# EasyEDA Pro project 外接板20260106.eprj

# Schematic Schematic1
Board Name: Board1; Create Date: 2025-08-14; Page Name: P1; Project Name: 外接板20250814 - 副本; Schematic Name: Schematic1; Update Date: 2025-11-26; Company: 嘉立创EDA; Page Size: A4; Version: V1.0
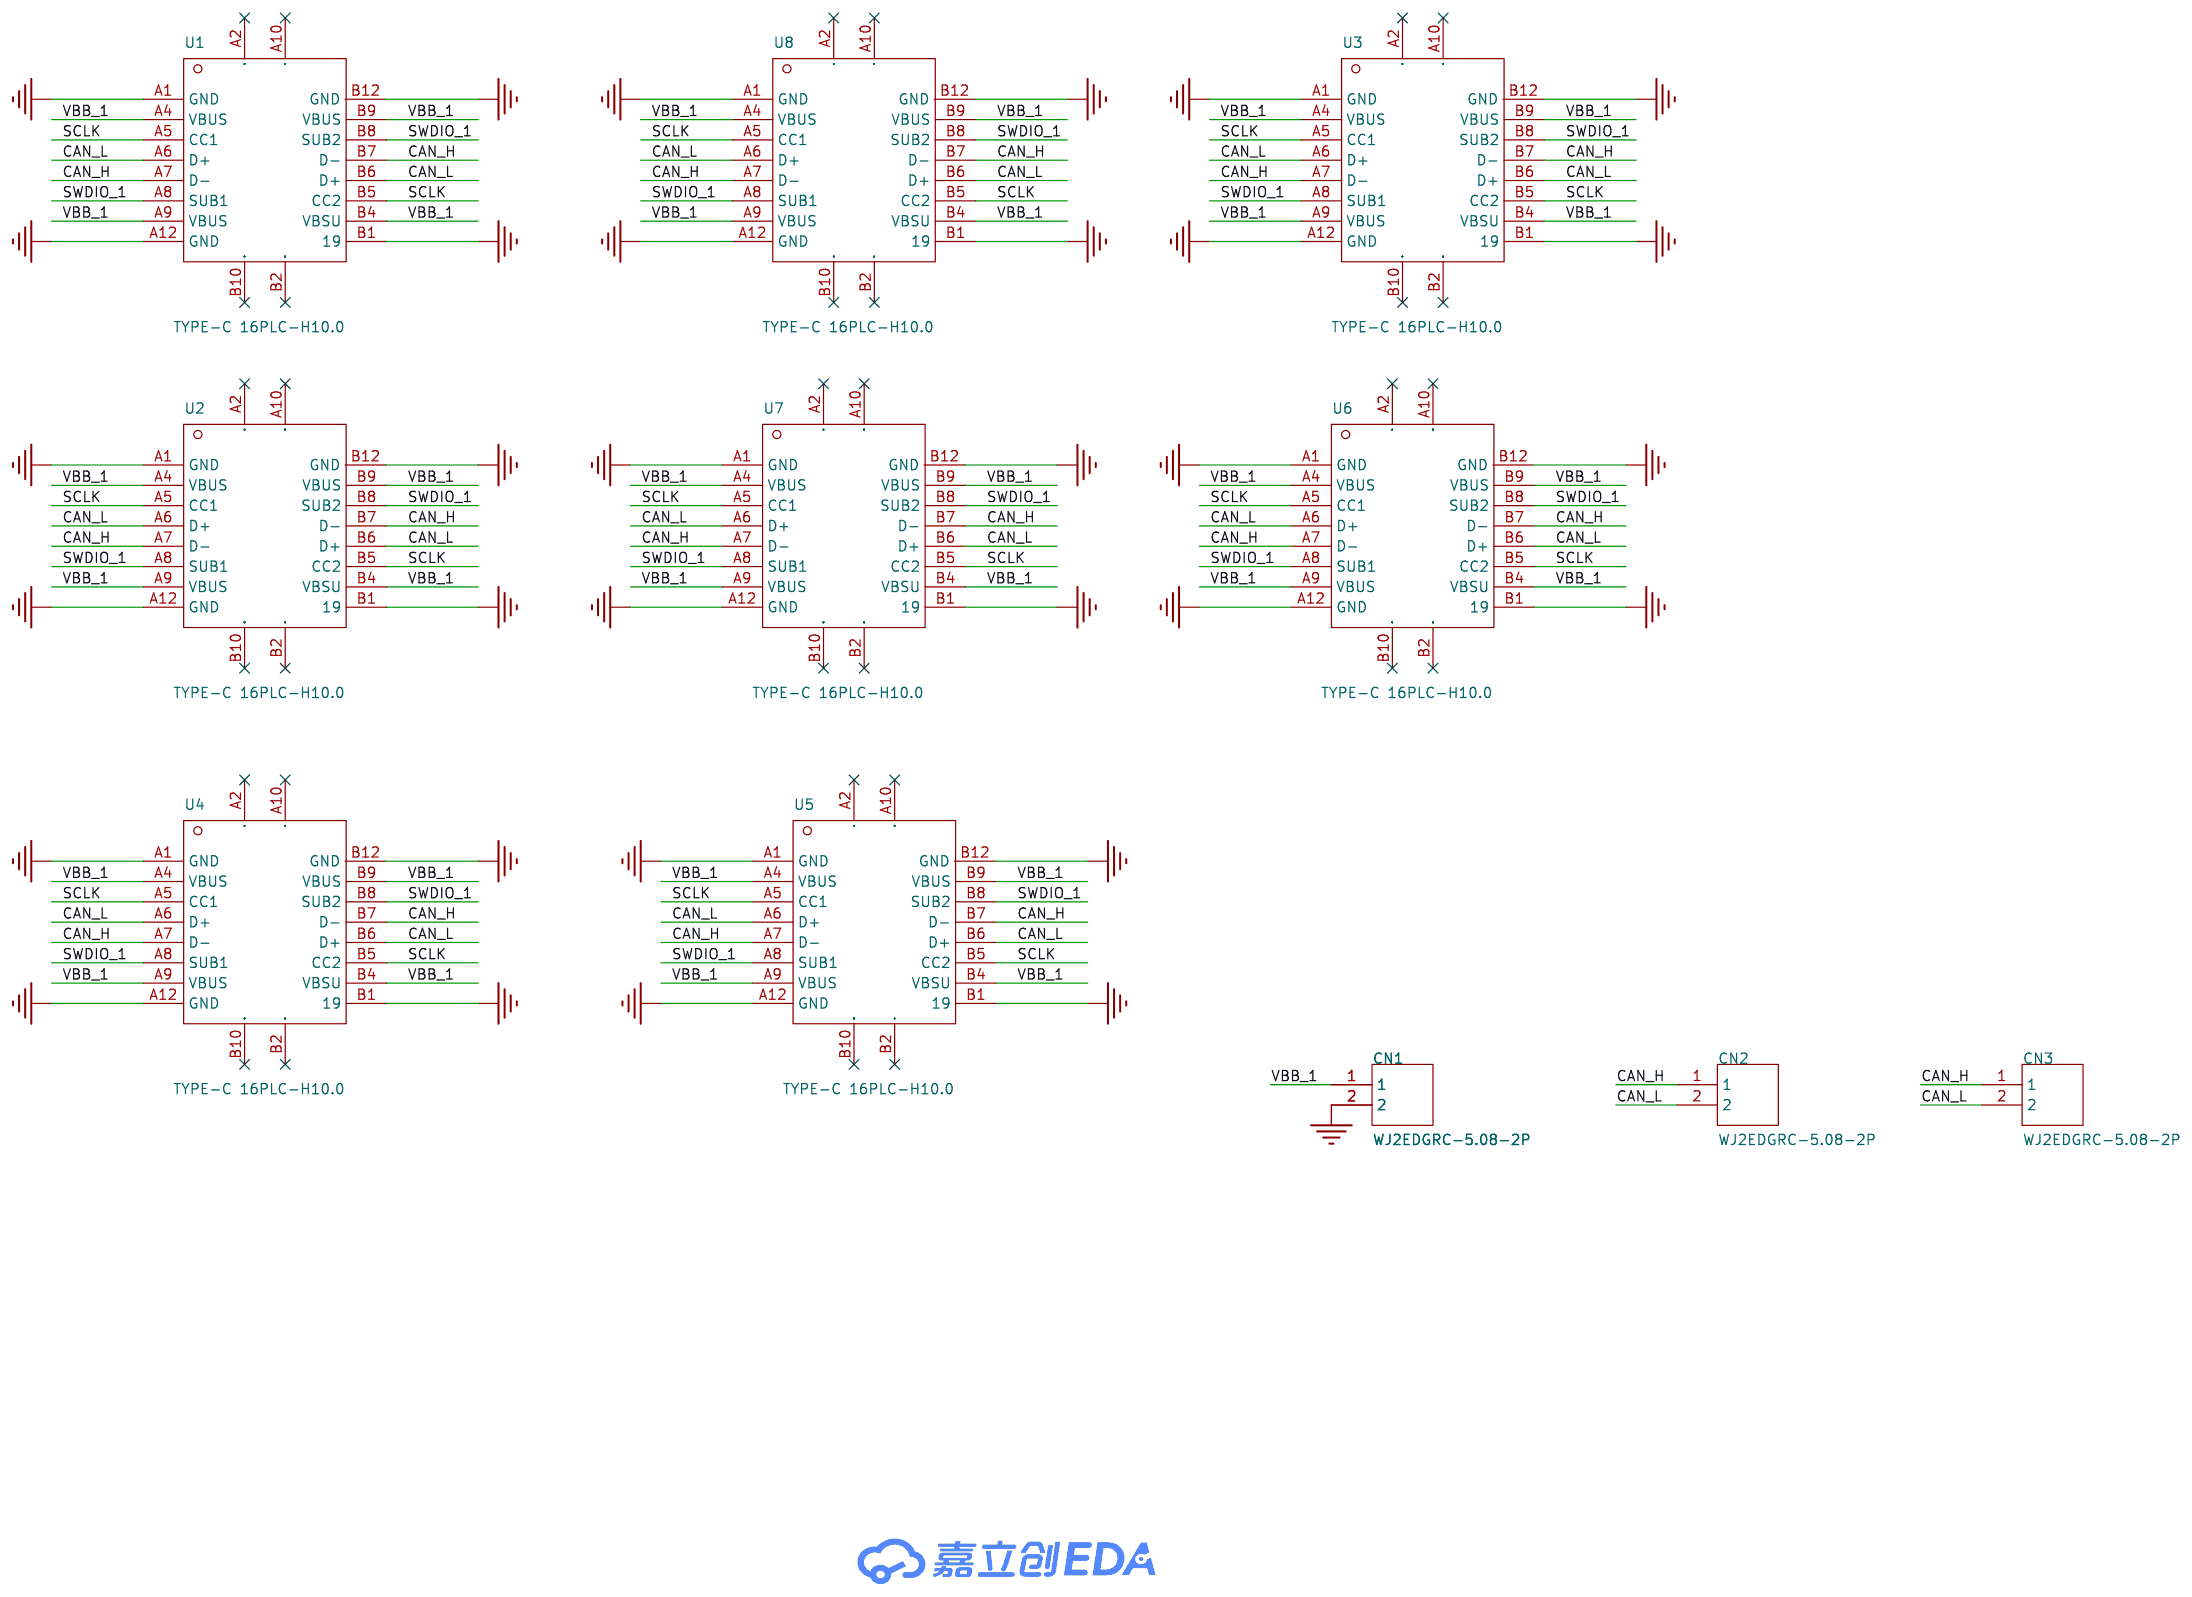
[diagram p0: schematic sheet]

## Parts
CN1  WJ2EDGRC-5.08-2P  [CONN-TH_2P-P5.08_WJ2EDGRC-5.08-2P]
CN2  WJ2EDGRC-5.08-2P  [CONN-TH_2P-P5.08_WJ2EDGRC-5.08-2P]
CN3  WJ2EDGRC-5.08-2P  [CONN-TH_2P-P5.08_WJ2EDGRC-5.08-2P]
U1  TYPE-C 16PLC-H10.0  [TYPE-C-TH_16PLC-H10.0]
U2  TYPE-C 16PLC-H10.0  [TYPE-C-TH_16PLC-H10.0]
U3  TYPE-C 16PLC-H10.0  [TYPE-C-TH_16PLC-H10.0]
U4  TYPE-C 16PLC-H10.0  [TYPE-C-TH_16PLC-H10.0]
U5  TYPE-C 16PLC-H10.0  [TYPE-C-TH_16PLC-H10.0]
U6  TYPE-C 16PLC-H10.0  [TYPE-C-TH_16PLC-H10.0]
U7  TYPE-C 16PLC-H10.0  [TYPE-C-TH_16PLC-H10.0]
U8  TYPE-C 16PLC-H10.0  [TYPE-C-TH_16PLC-H10.0]

## Library data of the parts
CN1-CN3 = WJ2EDGRC-5.08-2P: 连接器类型:板端/插座-闭口;固定方式:-;结构:1x2P;间距:5.08mm;颜色:绿色;安装方式:弯针;排数:1;每排PIN数:2;额定电流:20A;额定电压:450V;线规 - AWG:-;线规 - 平方毫米:-;触头材质:黄铜;触头镀层:锡;工作温度范围:-40℃~+105℃;焊接温度(最大值):-;; LCSC Part Name: 1x2P 5.08mm 排数:1 每排P数:2; Supplier Part: C3697; Manufacturer: KANGNEX(康奈克斯电气); Supplier Footprint: 弯插,P=5.08mm; JLCPCB Part Class: 扩展库; Datasheet: https://atta.szlcsc.com/upload/public/pdf/source/20240813/4D8AF133EBD88DD18E5AA0CE5EC77AA3.pdf; Supplier: LCSC; Connector Type: 板端/插座-闭口; Structure: 1x2P; Pitch: 5.08mm; Color: 绿色; Mounting Style: 弯针; Number of Pins: 2P; Number of Rows: 1; Number of PINs Per Row: 2; Current Rating (Max): 20A; Voltage Rating (Max): 450V; Contact Material: 黄铜; Contact Plating: 锡; Operating Temperature Range: -40℃~+105℃
U1-U8 = TYPE-C 16PLC-H10.0: 连接器类型:Type-C;标准:USB 3.1;公母:母;安装方式:直插;触点数量:16P;端口数量:1;额定电流 - 电源:5A;触头材质:-;触头镀层:-;工作温度范围:-40℃~+85℃;; LCSC Part Name: Type-C 母 直插; Supplier Part: C3151747; Manufacturer: SHOU HAN(首韩); Supplier Footprint: 插件; JLCPCB Part Class: 扩展库; Datasheet: https://atta.szlcsc.com/upload/public/pdf/source/20240529/CC9428849977884A813B584EA396EFE9.pdf; Supplier: LCSC; Connector Type: Type-C; Standard: USB 3.1; Gender: 母; Mounting Style: 直插; Number of Contacts: 16P; Number of Ports: 1; Current Rating - Power (Max): 5A; Operating Temperature Range: -40℃~+85℃; Rated Voltage (Max): 20V; Connect-Disconnect Life: 1万次; Core Colour: 黑色

## Nets
GND: CN1.2 U1.A1(GND) U1.A12(GND) U1.B1(19) U1.B12(GND) U2.A1(GND) U2.A12(GND) U2.B1(19) U2.B12(GND) U3.A1(GND) U3.A12(GND) U3.B1(19) U3.B12(GND) U4.A1(GND) U4.A12(GND) U4.B1(19) U4.B12(GND) U5.A1(GND) U5.A12(GND) U5.B1(19) U5.B12(GND) U6.A1(GND) U6.A12(GND) U6.B1(19) U6.B12(GND) U7.A1(GND) U7.A12(GND) U7.B1(19) U7.B12(GND) U8.A1(GND) U8.A12(GND) U8.B1(19) U8.B12(GND)
CAN_H: CN2.1 CN3.1 U1.A7(D-) U1.B7(D-) U2.A7(D-) U2.B7(D-) U3.A7(D-) U3.B7(D-) U4.A7(D-) U4.B7(D-) U5.A7(D-) U5.B7(D-) U6.A7(D-) U6.B7(D-) U7.A7(D-) U7.B7(D-) U8.A7(D-) U8.B7(D-)
CAN_L: CN2.2 CN3.2 U1.A6(D+) U1.B6(D+) U2.A6(D+) U2.B6(D+) U3.A6(D+) U3.B6(D+) U4.A6(D+) U4.B6(D+) U5.A6(D+) U5.B6(D+) U6.A6(D+) U6.B6(D+) U7.A6(D+) U7.B6(D+) U8.A6(D+) U8.B6(D+)
SCLK: U1.A5(CC1) U1.B5(CC2) U2.A5(CC1) U2.B5(CC2) U3.A5(CC1) U3.B5(CC2) U4.A5(CC1) U4.B5(CC2) U5.A5(CC1) U5.B5(CC2) U6.A5(CC1) U6.B5(CC2) U7.A5(CC1) U7.B5(CC2) U8.A5(CC1) U8.B5(CC2)
SWDIO_1: U1.A8(SUB1) U1.B8(SUB2) U2.A8(SUB1) U2.B8(SUB2) U3.A8(SUB1) U3.B8(SUB2) U4.A8(SUB1) U4.B8(SUB2) U5.A8(SUB1) U5.B8(SUB2) U6.A8(SUB1) U6.B8(SUB2) U7.A8(SUB1) U7.B8(SUB2) U8.A8(SUB1) U8.B8(SUB2)
VBB_1: CN1.1 U1.A4(VBUS) U1.A9(VBUS) U1.B4(VBSU) U1.B9(VBUS) U2.A4(VBUS) U2.A9(VBUS) U2.B4(VBSU) U2.B9(VBUS) U3.A4(VBUS) U3.A9(VBUS) U3.B4(VBSU) U3.B9(VBUS) U4.A4(VBUS) U4.A9(VBUS) U4.B4(VBSU) U4.B9(VBUS) U5.A4(VBUS) U5.A9(VBUS) U5.B4(VBSU) U5.B9(VBUS) U6.A4(VBUS) U6.A9(VBUS) U6.B4(VBSU) U6.B9(VBUS) U7.A4(VBUS) U7.A9(VBUS) U7.B4(VBSU) U7.B9(VBUS) U8.A4(VBUS) U8.A9(VBUS) U8.B4(VBSU) U8.B9(VBUS)

Not connected (* = marked no-connect by the designer): U1 A2(GND1)* A10(GND2)* B2(GND4)* B10(GND3)*; U2 A2(GND1)* A10(GND2)* B2(GND4)* B10(GND3)*; U3 A2(GND1)* A10(GND2)* B2(GND4)* B10(GND3)*; U4 A2(GND1)* A10(GND2)* B2(GND4)* B10(GND3)*; U5 A2(GND1)* A10(GND2)* B2(GND4)* B10(GND3)*; U6 A2(GND1)* A10(GND2)* B2(GND4)* B10(GND3)*; U7 A2(GND1)* A10(GND2)* B2(GND4)* B10(GND3)*; U8 A2(GND1)* A10(GND2)* B2(GND4)* B10(GND3)*

# Board PCB5
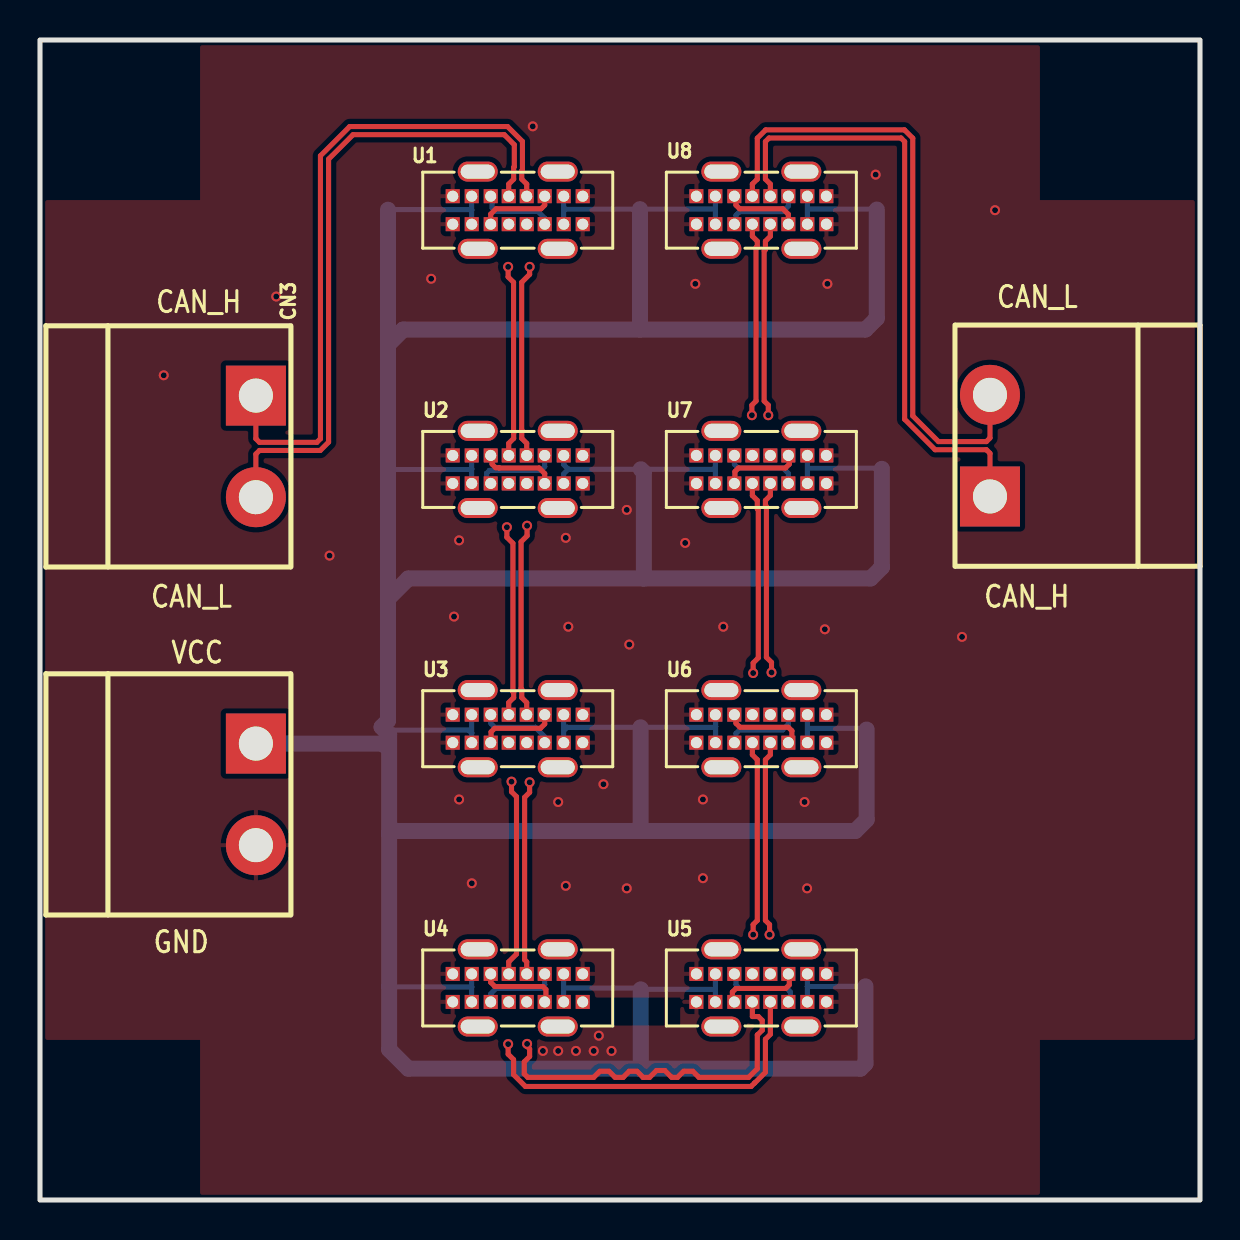
[diagram p1: board, top side]
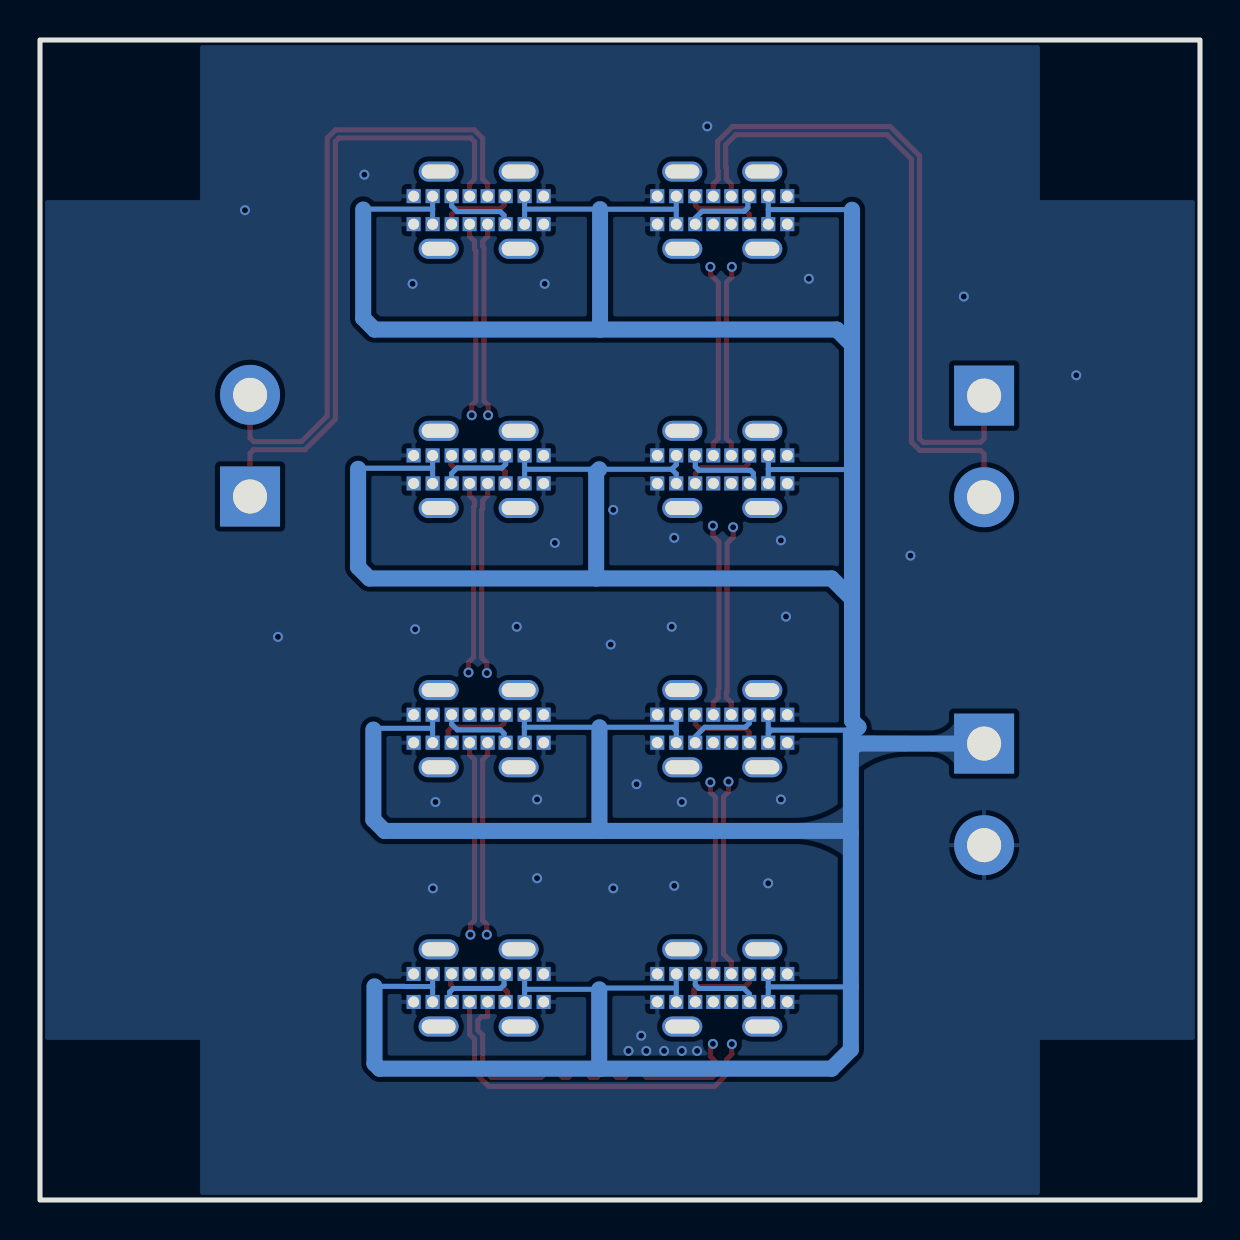
[diagram p2: board, bottom side, seen from below]

Outline 58 x 58 mm; copper layers: Top Layer, 内层1, 内层2, Bottom Layer. Coordinates in mm from the lower left corner of the outline.
Outline path: rectangle 0,58 58,0
Stack: Top Layer 0.035mm 外层铜厚1oz / Dielectric1 0.2104mm 7628 RC49% 8.6mil / 内层1 0.0152mm 内层铜厚 / Dielectric2 1.065mm 1.1mm H/HOZ Copper / 内层2 0.0152mm 内层铜厚 / Dielectric3 0.2104mm 7628 RC49% 8.6mil / Bottom Layer 0.035mm 外层铜厚1oz

## Design rules (mm)
net CAN_L: DP1
net CAN_H: DP1
template: JLCPCB Capability(Two Layers Board)
spacing copperThickness1oz (default): track to track 0.102, other pairs 0.152 to 0.3
spacing copperThickness2oz: track to track 0.203, other pairs 0.152 to 0.3
track width copperThickness1oz (default): min 0.127, default 0.254, max 2.54
track width copperThickness2oz: min 0.203, default 0.254, max 2.54
differential pair differentialPair (default): width min 0.127, default 0.254, max 2.54; gap min 0.152, default 0.152
via viaSize (default): diameter min 0.5, default 0.61, max 10; hole min 0.3, default 0.305, max 6.3

## Placement (name value [footprint] x y rotation side)
CN1  WJ2EDGRC-5.08-2P  [CONN-TH_2P-P5.08_WJ2EDGRC-5.08-2P]  10.79 20.28 270 top
CN2  WJ2EDGRC-5.08-2P  [CONN-TH_2P-P5.08_WJ2EDGRC-5.08-2P]  47.5 37.72 90 top
CN3  WJ2EDGRC-5.08-2P  [CONN-TH_2P-P5.08_WJ2EDGRC-5.08-2P]  10.79 37.68 270 top
U1  TYPE-C 16PLC-H10.0  [TYPE-C-TH_16PLC-H10.0]  23.89 49.49 0 top
U2  TYPE-C 16PLC-H10.0  [TYPE-C-TH_16PLC-H10.0]  23.89 36.53 0 top
U3  TYPE-C 16PLC-H10.0  [TYPE-C-TH_16PLC-H10.0]  23.89 23.57 0 top
U4  TYPE-C 16PLC-H10.0  [TYPE-C-TH_16PLC-H10.0]  23.89 10.6 0 top
U5  TYPE-C 16PLC-H10.0  [TYPE-C-TH_16PLC-H10.0]  36.07 10.6 0 top
U6  TYPE-C 16PLC-H10.0  [TYPE-C-TH_16PLC-H10.0]  36.07 23.57 0 top
U7  TYPE-C 16PLC-H10.0  [TYPE-C-TH_16PLC-H10.0]  36.07 36.53 0 top
U8  TYPE-C 16PLC-H10.0  [TYPE-C-TH_16PLC-H10.0]  36.07 49.49 0 top

## Footprints (pads in the part's own frame, mm; a bottom-side part is the same pattern mirrored in y, then rotated)
CONN-TH_2P-P5.08_WJ2EDGRC-5.08-2P
  rect 3x3 hole 1.7: 1(-2.54,0)
  round 3 hole 1.7: 2(2.54,0)
TYPE-C-TH_16PLC-H10.0
  rect 0.7x0.7 hole 0.55: A1(-3.25,0.7) A4(-2.3,0.7) A5(-1.351,0.7) A6(-0.45,0.7) A7(0.45,0.7) A8(1.35,0.7) A9(2.3,0.7) A12(3.25,0.7) B1(3.25,-0.7) B4(2.3,-0.7) B5(1.35,-0.7) B6(0.45,-0.7) B7(-0.45,-0.7) B8(-1.351,-0.7) B9(-2.3,-0.7) B12(-3.25,-0.7)
  oval 2x1 hole 1.7x0.7: A2(-2,1.93) A10(2,1.93) B2(2,-1.93) B10(-2,-1.93)

## Nets
As in the schematic.

Pads without a net: U1 A2 A10 B2 B10; U2 A2 A10 B2 B10; U3 A2 A10 B2 B10; U4 A2 A10 B2 B10; U5 A2 A10 B2 B10; U6 A2 A10 B2 B10; U7 A2 A10 B2 B10; U8 A2 A10 B2 B10

## Via types
v1: diameter 0.5, hole 0.3, Top Layer to Bottom Layer, 49 vias

## Routing (per net, layer and track width the routed paths; a pad name or vN(x,y) marks a point on that pad's centre or on a via; arc(x,y) is an arc through that point)
GND:
  vias: v1(6.19,41.24) v1(11.81,45.17) v1(14.48,32.22) v1(19.56,46.06) v1(20.7,29.17) v1(20.96,32.98) v1(20.96,20.03) v1(21.59,15.84) v1(24.64,53.68) v1(25.15,7.45) v1(25.91,19.9) v1(25.91,7.45) v1(26.29,33.11) v1(26.29,15.71) v1(26.42,28.66) v1(26.8,7.45) v1(27.69,7.45) v1(27.94,8.22) v1(28.17,20.79) v1(28.57,7.45) v1(29.34,34.5) v1(29.34,15.58) v1(29.46,27.77) v1(32.26,32.85) v1(32.77,45.81) v1(33.15,20.03) v1(33.15,16.09) v1(34.16,28.66) v1(38.23,19.9) v1(38.35,15.58) v1(39.24,28.54) v1(39.37,45.81) v1(41.78,51.27) v1(46.1,28.16) v1(47.75,49.49)
CAN_H: length 175.1
  Top Layer w0.254: U7.B7 35.62,35.22 35.87,34.98 35.87,34.56 35.91,34.51 35.91,27.11 35.66,26.85 v1(35.66,26.35) ; v1(24.48,46.66) 24.48,46.28 24.08,45.88 24.08,38.51 24.09,38.5 24.09,38.08 24.34,37.83 U2.A7 ; U6.B7 35.62,22.26 35.87,22.01 35.87,13.98 35.66,13.77 v1(35.66,13.27) ; U3.A7 24.34,24.87 24.09,25.12 24.09,25.54 24.05,25.58 24.05,32.91 24.35,33.21 v1(24.35,33.71) ; U8.B7 35.62,48.19 35.87,47.94 35.87,47.69 35.8,47.62 35.8,39.95 35.59,39.74 v1(35.59,39.24) ; U8.A7 36.52,50.8 36.27,51.04 36.27,52.92 36.45,53.1 43.05,53.1 43.23,52.92 43.23,39.04 44.75,37.51 47.32,37.51 47.5,37.33 CN2.1 ; v1(24.35,7.81) 24.35,7.68 24.48,7.55 24.48,7.17 24.21,6.9 24.21,6.31 24.39,6.13 27.69,6.13 27.99,6.44 28.45,6.44 28.75,6.13 29.16,6.13 29.46,6.44 29.84,6.44 30.15,6.13 30.48,6.13 30.82,6.47 31.24,6.47 31.59,6.13 31.88,6.13 32.18,6.44 32.64,6.44 32.95,6.13 35.43,6.13 35.87,6.56 35.87,8.26 35.88,8.26 36.11,8.49 36.11,8.98 35.92,9.17 35.62,9.17 U5.B7 ; U1.A7 24.34,50.8 24.09,51.04 24.09,51.46 24.12,51.5 24.12,52.93 23.38,53.67 15.49,53.67 14.02,52.21 14.02,38.06 13.84,37.88 10.97,37.88 10.79,38.06 CN3.1 ; v1(24.48,20.89) 24.48,20.38 24.23,20.13 24.23,12.01 24.34,11.91 U4.A7
  内层1 w0.254: U8.B7 35.62,49.26 35.81,49.46 36.36,49.46 36.52,49.62 U8.A7 ; U1.A7 24.34,49.7 24.13,49.49 23.62,49.49 23.44,49.31 U1.B7 23.5,48.73 23.5,47.78 24.42,46.86 24.42,46.72 v1(24.48,46.66) ; U4.A7 24.34,10.83 24.11,10.61 23.59,10.61 23.44,10.45 U4.B7 23.44,8.72 v1(24.35,7.81) ; v1(35.66,13.27) 36.52,12.41 U5.A7 36.52,10.76 36.34,10.58 36.3,10.61 35.81,10.61 35.62,10.42 U5.B7 ; v1(35.59,39.24) 36.52,38.31 U7.A7 36.52,36.66 36.36,36.5 35.78,36.5 35.62,36.34 U7.B7 ; v1(24.35,33.71) 23.44,34.63 U2.B7 23.44,36.3 23.62,36.48 24.13,36.48 24.34,36.69 U2.A7 ; v1(24.48,20.89) 23.56,21.81 23.56,22.74 U3.B7 23.44,23.38 23.62,23.57 24.12,23.57 24.34,23.79 U3.A7 ; v1(35.66,26.35) 36.52,25.49 U6.A7 36.52,23.84 36.26,23.58 35.81,23.58 35.62,23.39 U6.B7
CAN_L: length 175.2
  Top Layer w0.254: U6.B6 36.52,22.26 36.27,22.01 36.27,13.98 36.48,13.77 v1(36.48,13.27) ; U3.A6 23.44,24.87 23.68,25.12 23.68,25.37 23.65,25.41 23.65,32.83 23.34,33.14 v1(23.34,33.64) ; v1(23.41,7.8) 23.41,7.29 23.68,7.02 23.68,6.27 24.27,5.68 35.55,5.68 35.73,5.85 35.74,5.85 36.27,6.39 36.27,8.04 36.52,8.28 U5.B6 ; U2.A6 23.44,37.83 23.68,38.08 23.68,38.33 23.68,38.34 23.68,45.88 23.41,46.15 v1(23.41,46.66) ; v1(36.41,39.24) 36.41,39.74 36.21,39.95 36.21,47.45 36.27,47.52 36.27,47.94 36.52,48.19 U8.B6 ; v1(36.58,26.38) 36.58,26.88 36.32,27.14 36.32,34.67 36.27,34.72 36.27,34.98 36.52,35.22 U7.B6 ; U1.A6 23.44,50.8 23.68,51.04 23.68,51.63 23.72,51.67 23.72,52.76 23.21,53.27 15.65,53.27 14.43,52.04 14.43,37.89 14.01,37.48 10.97,37.48 10.79,37.3 CN3.2 ; U8.A6 35.62,50.8 35.87,51.04 35.87,53.09 36.28,53.51 43.22,53.51 43.64,53.09 43.64,39.2 44.92,37.92 47.32,37.92 47.5,38.1 CN2.2 ; U4.A6 23.44,11.91 23.82,12.3 23.82,20.16 23.58,20.41 v1(23.58,20.92)
  内层2 w0.254: U2.A6 23.44,36.72 23.62,36.54 24.13,36.54 24.34,36.33 U2.B6 24.34,34.63 v1(23.34,33.64) ; U3.A6 23.44,23.77 23.62,23.58 24.13,23.58 24.34,23.38 U3.B6 24.34,21.55 23.7,20.92 v1(23.58,20.92) ; U8.B6 36.52,49.3 36.32,49.49 35.81,49.49 35.62,49.69 U8.A6 ; U5.B6 36.52,10.4 36.32,10.59 35.78,10.59 35.62,10.76 U5.A6 35.62,12.41 v1(36.48,13.27) ; v1(36.41,39.24) 35.62,38.44 U7.A6 35.62,36.66 35.78,36.5 36.32,36.5 36.52,36.31 U7.B6 ; v1(36.58,26.38) 35.62,25.42 U6.A6 35.62,23.65 35.78,23.49 36.08,23.49 36.09,23.49 36.32,23.49 36.52,23.29 U6.B6 ; v1(23.41,46.66) 23.53,46.66 24.46,47.59 24.46,48.66 U1.B6 24.34,49.23 24.07,49.49 23.62,49.49 23.44,49.68 U1.A6 ; v1(23.41,7.8) 24.34,8.72 U4.B6 24.34,10.42 24.13,10.63 23.62,10.63 23.44,10.81 U4.A6
SCLK: length 112.1
  Top Layer w0.254: U8.A5 34.8,50.11 34.8,49.75 34.98,49.56 37.14,49.56 37.42,49.28 U8.B5 ; U6.A5 34.8,24.19 34.8,23.84 35,23.64 37.42,23.64 37.59,23.46 37.59,22.93 37.53,22.87 U6.B5 ; U2.B5 25.24,36.32 24.96,36.6 22.97,36.6 22.96,36.61 22.79,36.61 22.61,36.79 22.61,37.16 U2.A5 ; U4.A5 22.54,10.88 22.75,10.67 25.15,10.67 25.3,10.52 25.3,9.96 U4.B5
  内层2 w0.254: 28.63,10.55 25.45,10.55 25.27,10.38 25.27,9.94 U4.B5 ; 28.63,10.55 28.7,10.63 28.7,23.46 ; 28.63,10.55 34.42,10.55 34.72,10.86 U5.A5 ; 28.7,36.59 28.7,23.46 ; 28.7,36.59 28.7,49.24 28.52,49.42 ; 28.7,36.59 25.45,36.59 25.27,36.41 25.27,35.86 U2.B5 ; 28.7,36.59 28.75,36.54 34.54,36.54 34.72,36.71 U7.A5 ; 28.7,23.46 28.65,23.51 25.45,23.51 25.27,23.33 25.27,22.9 U3.B5 ; 28.7,23.46 32.32,23.46 32.35,23.49 34.09,23.49 34.4,23.8 34.4,23.94 U6.A5 ; U8.A5 34.4,49.87 34.4,49.73 34.23,49.56 34.09,49.56 33.95,49.42 28.52,49.42 ; U1.B5 25.27,48.83 25.27,49.35 25.34,49.42 28.52,49.42
  Bottom Layer w0.254: U7.B5 37.42,36.33 37.15,36.6 34.91,36.6 34.72,36.79 U7.A5 ; U1.B5 25.24,49.09 24.89,49.44 22.79,49.44 22.61,49.62 22.61,50.12 U1.A5 ; U3.B5 25.24,23.17 24.76,23.64 22.74,23.64 22.54,23.84 U3.A5 ; U5.A5 34.8,11.22 34.8,10.76 34.98,10.58 37.34,10.58 37.52,10.4 37.52,10 U5.B5
SWDIO_1: length 113
  Top Layer w0.254: U1.A8 25.24,49.75 25.05,49.56 22.8,49.56 22.54,49.29 U1.B8 ; U3.A8 25.24,23.8 25.02,23.58 22.73,23.58 22.55,23.4 22.55,22.88 U3.B8 ; U5.B8 34.62,10 34.62,10.4 34.8,10.58 37.29,10.58 37.47,10.76 37.47,11.26 U5.A8 ; U7.A8 37.47,37.18 37.47,36.79 37.27,36.6 34.93,36.6 34.75,36.42 34.75,35.86 U7.B8
  内层1 w0.254: U2.A8 25.24,37.08 25.72,36.6 30.01,36.6 30.1,36.69 ; 30.07,23.53 29.96,23.42 29.96,10.58 ; 30.07,23.53 25.45,23.53 25.27,23.71 25.27,24.23 U3.A8 ; 30.07,23.53 30.1,23.56 ; 29.96,10.58 34.34,10.58 34.72,10.2 U5.B8 ; 29.96,10.58 25.45,10.58 25.27,10.76 25.27,11.27 U4.A8 ; 30.1,36.69 30.1,49.57 ; 30.1,36.69 30.2,36.59 34.54,36.59 34.72,36.41 U7.B8 ; 30.1,36.69 30.1,23.56 ; 30.1,49.57 27.6,49.57 27.6,49.56 25.72,49.56 25.72,49.57 25.45,49.57 25.27,49.75 25.27,50.15 U1.A8 ; 30.1,49.57 30.15,49.57 30.17,49.54 34.62,49.54 34.8,49.36 34.8,48.87 U8.B8 ; 30.1,23.56 30.17,23.64 34.54,23.64 34.72,23.46 U6.B8
  Bottom Layer w0.254: U4.A8 25.24,10.76 25.06,10.58 22.81,10.58 22.54,10.3 U4.B8 ; U2.A8 25.24,36.66 25.06,36.48 22.48,36.48 22.33,36.34 22.33,36.02 22.52,35.83 U2.B8 ; U6.A8 37.42,23.79 37.14,23.51 34.98,23.51 34.8,23.33 34.8,22.95 U6.B8 ; U8.A8 37.42,49.7 37.14,49.42 34.98,49.42 34.8,49.24 34.8,48.87 U8.B8
VBB_1: length 269.7
  Bottom Layer w0.254: 38.37,49.55 38.38,49.54 41.82,49.54 41.84,49.52 ; 38.37,49.55 U8.A9 ; 38.37,49.55 U8.B4 ; 38.48,23.58 41.27,23.58 41.33,23.52 ; 26.42,36.54 26.19,36.77 U2.A9 ; 26.42,36.54 33.66,36.54 ; 26.42,36.54 26.19,36.31 U2.B4 ; U2.A4 21.59,36.55 ; 21.59,36.55 U2.B9 ; 21.59,36.55 21.56,36.52 17.4,36.52 ; 26.19,10.6 U4.B4 ; 26.19,10.6 29.97,10.6 30.04,10.53 33.76,10.53 33.77,10.54 ; 26.19,10.6 U4.A9 ; 33.77,49.54 U8.B9 ; 33.77,49.54 30,49.54 29.99,49.54 26.19,49.54 ; 33.77,49.54 U8.A4 ; 33.78,23.66 33.78,24.25 U6.A4 ; 33.78,23.66 33.75,23.64 26.37,23.64 26.19,23.46 ; 33.78,23.66 33.78,22.88 U6.B9 ; U1.B9 21.59,49.52 ; 21.59,49.52 U1.A4 ; 21.59,49.52 17.41,49.52 17.4,49.51 ; 38.37,36.59 42.06,36.59 42.09,36.56 ; U7.A9 U7.B4 ; U3.A4 21.59,23.33 ; 21.59,23.33 U3.B9 ; 21.59,23.33 21.42,23.49 17.68,23.49 17.46,23.27 ; U3.B4 26.19,23.46 ; 26.19,23.46 U3.A9 ; U6.A9 U6.B4 ; 26.19,49.54 U1.A9 ; 26.19,49.54 U1.B4 ; 21.59,10.66 17.47,10.66 17.46,10.67 ; 21.59,10.66 U4.A4 ; 21.59,10.66 U4.B9 ; 33.77,10.54 U5.B9 ; 33.77,10.54 U5.A4 ; 41.28,10.68 39.79,10.68 39.78,10.67 38.38,10.67 38.37,10.66 ; 38.37,10.66 U5.A9 ; 38.37,10.66 U5.B4 ; U7.A4 U7.B9
  Bottom Layer w0.8: 30.04,10.53 30.04,6.63 29.97,6.56 ; 17.27,22.69 17.15,22.82 10.79,22.82 ; 30.04,36.54 30.19,36.39 30.19,31.08 ; 17.4,42.76 17.4,30.06 ; 17.4,42.76 17.4,49.51 ; 17.4,42.76 18.16,43.52 30,43.52 ; 30.19,31.08 18.41,31.08 17.4,30.06 ; 30.19,31.08 41.53,31.08 42.09,31.64 42.09,36.56 ; 17.4,30.06 17.4,23.97 17.08,23.65 17.46,23.27 17.46,18.33 ; 29.97,6.56 41.02,6.56 41.28,6.82 41.28,10.68 ; 29.97,6.56 18.41,6.56 17.46,7.52 17.46,18.33 ; 29.94,18.45 40.77,18.45 41.33,19.02 41.33,23.52 ; 29.94,18.45 30.03,18.54 30.03,23.64 ; 29.94,18.45 17.58,18.45 17.46,18.33 ; 30,43.52 41.28,43.52 41.84,44.09 41.84,49.52 ; 30,43.52 30,49.54

## Copper pours and planes (outline as drawn; the poured copper is in the pictures)
GND on Top Layer: -2.29,59.52 61.72,59.52 61.72,-1.44 -2.29,-1.44
GND on Bottom Layer: -1.02,58.25 59.31,58.25 59.31,-0.8 -1.02,-0.8
GND on 内层1: -1.14,59.02 58.17,59.02 58.17,-1.06 -1.14,-1.06
GND on 内层2: -1.4,59.02 60.96,59.02 60.96,-0.8 -1.4,-0.8

Small or netless copper shapes (teardrops, artwork), in the pictures only: 4 on Top Layer, 3 on Bottom Layer, 3 on 内层1

## Text on the board
Top Silkscreen Layer: CAN_L | CAN_H | GND | VCC
